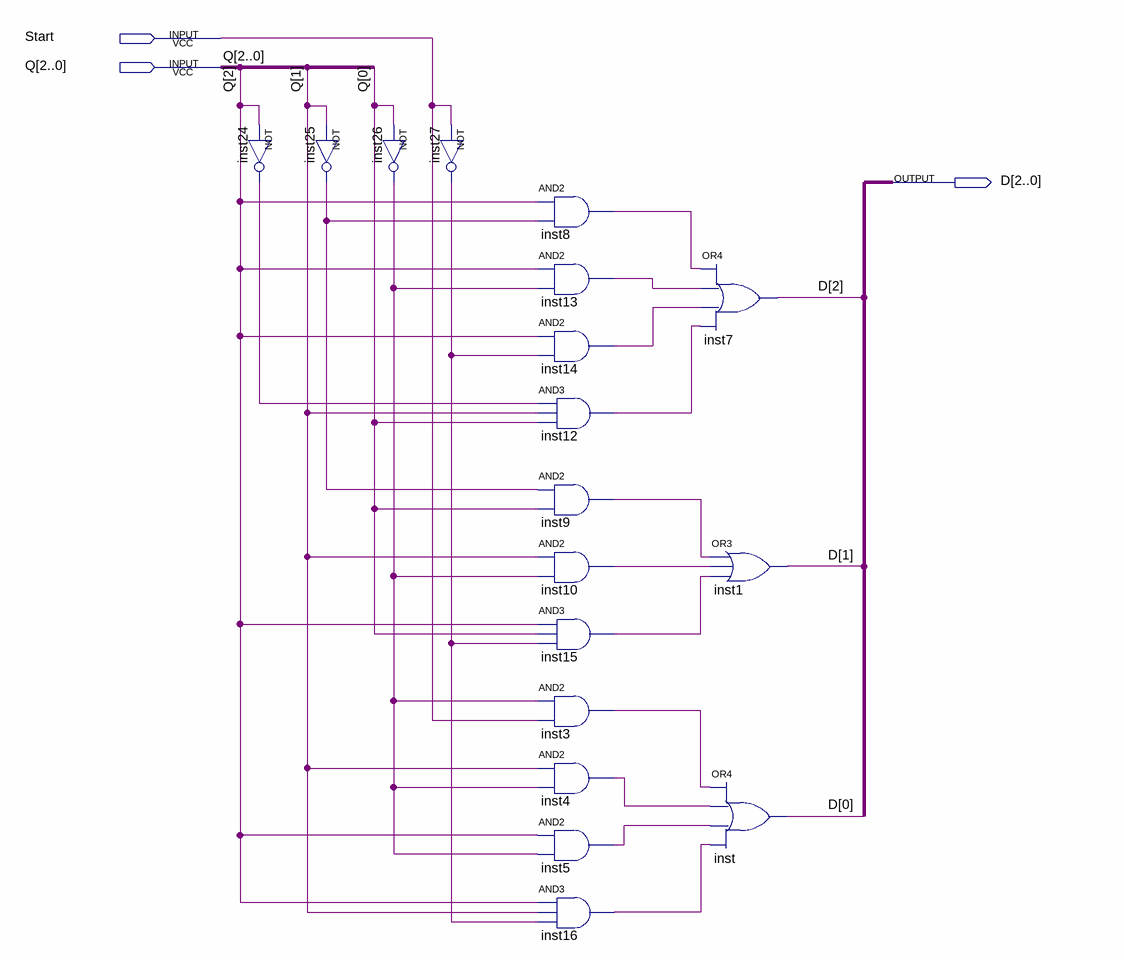
[diagram p0: schematic sheet]
// Quartus schematic Next_state.bdf as structural Verilog: 18 symbols, 3 pins
module Next_state (
  input  Start,
  input  [2:0] Q,
  output [2:0] D
);

  wire inst3_out, inst4_out, inst5_out, inst8_out, inst9_out, inst10_out, inst12_out, inst13_out, inst14_out,
       inst15_out, inst16_out, inst24_out, inst25_out, inst26_out, inst27_out;

  not inst24 (inst24_out, Q[2]);
  not inst25 (inst25_out, Q[1]);
  not inst26 (inst26_out, Q[0]);
  not inst27 (inst27_out, Start);
  and inst8 (inst8_out, Q[2], inst25_out);
  and inst13 (inst13_out, Q[2], inst26_out);
  and inst14 (inst14_out, Q[2], inst27_out);
  and inst12 (inst12_out, inst24_out, Q[1], Q[0]);
  and inst9 (inst9_out, inst25_out, Q[0]);
  and inst10 (inst10_out, Q[1], inst26_out);
  and inst15 (inst15_out, Q[2], Q[0], inst27_out);
  and inst3 (inst3_out, inst26_out, Start);
  and inst4 (inst4_out, Q[1], inst26_out);
  and inst5 (inst5_out, Q[2], inst26_out);
  and inst16 (inst16_out, Q[2], Q[1], inst27_out);
  or inst7 (D[2], inst8_out, inst13_out, inst14_out, inst12_out);
  or inst1 (D[1], inst9_out, inst10_out, inst15_out);
  or inst (D[0], inst3_out, inst4_out, inst5_out, inst16_out);
endmodule
